# Altium schematic sheet SignalAndKeyController.SchDoc: Signal And Key Controller
size A4; Author: eldar6776@hotmail.com; DrawnBy: Eldar Dedić; Organization: PROVEN d.o.o.; Address1: Adema Buće 102; Address2: 71000 Sarajevo; Address3: Federacija BiH; Address4: Bosna i Hercegovina; DocumentNumber: DE211213; Revision: 001; SheetNumber: 10; SheetTotal: 15; ProjectName: MIKSER SIROVINE
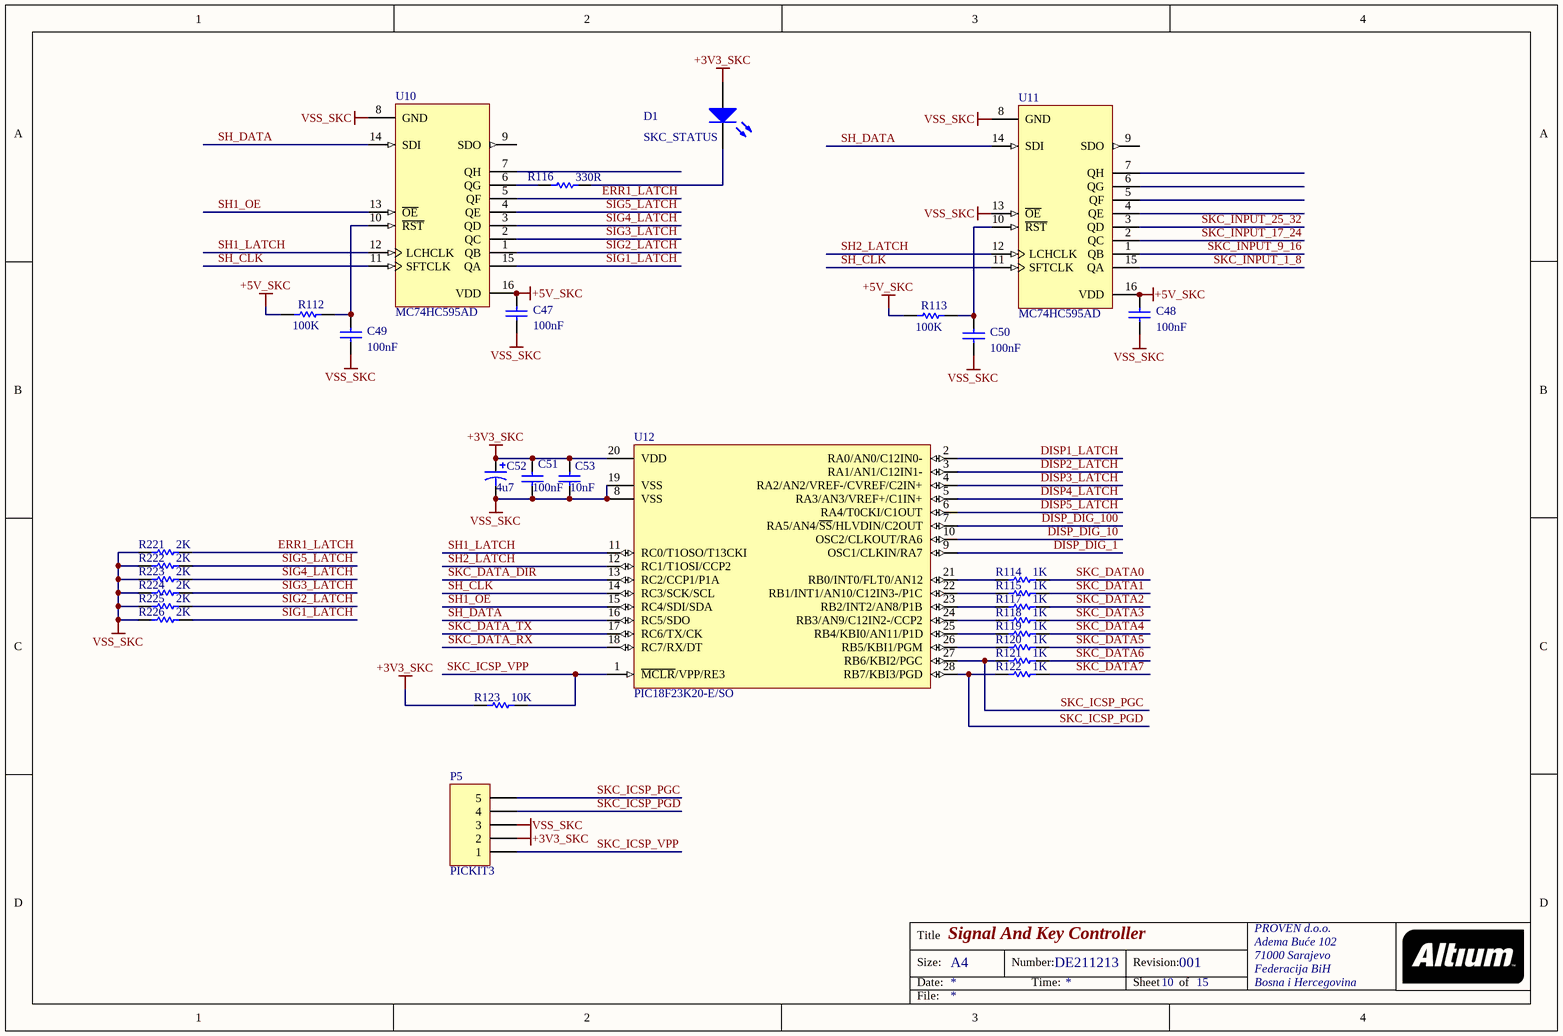
[diagram p0: SignalAndKeyController.SchDoc]

## Parts
C47  value 100nF  [1206]
C48  value 100nF  [1206]
C49  value 100nF  [1206]
C50  value 100nF  [1206]
C51  value 100nF  [1206]
C52  4u7  [C]
C53  value 10nF  [0805]
D1  SKC_STATUS  [2.0X1.25X0.8]
P5  PICKIT3  [HDR1X5]
R112  100K  [ERA-0603]
R113  100K  [ERA-0603]
R114  1K  [ERA-0603]
R115  1K  [ERA-0603]
R116  330R  [ERA-0603]
R117  1K  [ERA-0603]
R118  1K  [ERA-0603]
R119  1K  [ERA-0603]
R120  1K  [ERA-0603]
R121  1K  [ERA-0603]
R122  1K  [ERA-0603]
R123  10K  [ERA-0603]
R221  2K  [ERA-0603]
R222  2K  [ERA-0603]
R223  2K  [ERA-0603]
R224  2K  [ERA-0603]
R225  2K  [ERA-0603]
R226  2K  [ERA-0603]
U10  MC74HC595AD  [751B-05_N]
U11  MC74HC595AD  [751B-05_N]
U12  PIC18F23K20-E/SO  [SOIC-SO28_N]

## Nets
+3V3_SKC: C51.2 C52.1 C53.2 D1.1(A) P5.2 R123.1 U12.20(VDD)
+5V_SKC: C47.2 C48.2 R112.1 R113.1 U10.16(VDD) U11.16(VDD)
VSS_SKC: C47.1 C48.1 C49.1 C50.1 C51.1 C52.2 C53.1 P5.3 R221.2 R222.2 R223.2 R224.2 R225.2 R226.2 U10.8(GND) U11.8(GND) U11.13(~{OE}) U12.8(VSS) U12.19(VSS)
DISP1_LATCH: U12.2(RA0/AN0/C12IN0-)
DISP2_LATCH: U12.3(RA1/AN1/C12IN1-)
DISP3_LATCH: U12.4(RA2/AN2/VREF-/CVREF/C2IN+)
DISP4_LATCH: U12.5(RA3/AN3/VREF+/C1IN+)
DISP5_LATCH: U12.6(RA4/T0CKI/C1OUT)
DISP_DIG_1: U12.9(OSC1/CLKIN/RA7)
DISP_DIG_10: U12.10(OSC2/CLKOUT/RA6)
DISP_DIG_100: U12.7(RA5/AN4/~{SS}/HLVDIN/C2OUT)
ERR1_LATCH: R221.1 U10.5(QF)
SH1_LATCH: U10.12(LCHCLK) U12.11(RC0/T1OSO/T13CKI)
SH1_OE: U10.13(~{OE}) U12.15(RC4/SDI/SDA)
SH2_LATCH: U11.12(LCHCLK) U12.12(RC1/T1OSI/CCP2)
SH_CLK: U10.11(SFTCLK) U11.11(SFTCLK) U12.14(RC3/SCK/SCL)
SH_DATA: U10.14(SDI) U11.14(SDI) U12.16(RC5/SDO)
SIG1_LATCH: R226.1 U10.15(QA)
SIG2_LATCH: R225.1 U10.1(QB)
SIG3_LATCH: R224.1 U10.2(QC)
SIG4_LATCH: R223.1 U10.3(QD)
SIG5_LATCH: R222.1 U10.4(QE)
SKC_DATA0: R114.2
SKC_DATA1: R115.2
SKC_DATA2: R117.2
SKC_DATA3: R118.2
SKC_DATA4: R119.2
SKC_DATA5: R120.2
SKC_DATA6: R121.2
SKC_DATA7: R122.2
SKC_DATA_DIR: U12.13(RC2/CCP1/P1A)
SKC_DATA_RX: U12.18(RC7/RX/DT)
SKC_DATA_TX: U12.17(RC6/TX/CK)
SKC_ICSP_PGC: P5.5 R121.1 U12.27(RB6/KBI2/PGC)
SKC_ICSP_PGD: P5.4 R122.1 U12.28(RB7/KBI3/PGD)
SKC_ICSP_VPP: P5.1 R123.2 U12.1(~{MCLR}/VPP/RE3)
SKC_INPUT_1_8: U11.15(QA)
SKC_INPUT_9_16: U11.1(QB)
SKC_INPUT_17_24: U11.2(QC)
SKC_INPUT_25_32: U11.3(QD)
NetC49_2: C49.2 R112.2 U10.10(~{RST})
NetC50_2: C50.2 R113.2 U11.10(~{RST})
NetD1_2: D1.2(K) R116.2
NetR114_1: R114.1 U12.21(RB0/INT0/FLT0/AN12)
NetR115_1: R115.1 U12.22(RB1/INT1/AN10/C12IN3-/P1C)
NetR116_1: R116.1 U10.6(QG)
NetR117_1: R117.1 U12.23(RB2/INT2/AN8/P1B)
NetR118_1: R118.1 U12.24(RB3/AN9/C12IN2-/CCP2)
NetR119_1: R119.1 U12.25(RB4/KBI0/AN11/P1D)
NetR120_1: R120.1 U12.26(RB5/KBI1/PGM)

Not connected (* = marked no-connect by the designer): U10 7(QH) 9(SDO); U11 4(QE) 5(QF) 6(QG) 7(QH) 9(SDO)

## Notes on the sheet
- Title
- Size:
- Date:
- A4
- Number:
- Time:
- Revision:
- Sheet
- of
- File:

## Library data of the parts
C47-C51 = C1206: Ceramic Chip Capacitor - Standard; Published: 17-Jul-2002; LatestRevisionDate: 19-Mar-2004; LatestRevisionNote: Silkscreen size reduced.; DatasheetDocument: Mar-2001; PackageDocument: Mar-2001; PackageReference: 1206; Publisher: Altium Limited; Code_JEITA: 1206; Code_IPC: 3216 [1206]; ComponentLink1Description: Manufacturer Link; ComponentLink1URL: http://www.kemet.com/; ComponentLink2Description: Datasheet; ComponentLink2URL: http://www.kemet.com/kemet/web/homepage/kechome.nsf/vapubfilesname/F3102TA.pdf/$file/F3102TA.pdf
C52 = 94SC475X0025CBP: Solid Aluminum Capacitor with Organic Semiconductor Electrolyte: 4.7uF, 25V, Bulk Pack; Note: Part Numbers shown are for ± 20% capacitance tolerance (X0).; PCB_Layout: Complies with Manufacturer's Recommendation.; DrillSize: Nominal, Rounded to the nearest 0.1mm; Published: 19-Mar-2004; DatasheetDocument: 23-May-2001; PackageReference: C; Publisher: Altium Limited; ComponentLink1Description: Manufacturer Link; ComponentLink1URL: http://www.vishay.com/; ComponentLink2Description: Datasheet; ComponentLink2URL: http://www.vishay.com/docs/90004/94sc.pdf; Value: 4.7uF
C53 = C0805: Ceramic Chip Capacitor - Standard; Note: Footprint corresponds to dimensions for bulk cassette packaging. This case size has tightened tolerances.; Published: 17-Jul-2002; LatestRevisionDate: 19-Mar-2004; LatestRevisionNote: Silkscreen size reduced.; DatasheetDocument: Mar-2001; PackageDocument: Mar-2001; PackageReference: 0805; Publisher: Altium Limited; Code_JEITA: 0805; Code_IPC: 2012[0805]; ComponentLink1Description: Manufacturer Link; ComponentLink1URL: http://www.kemet.com/; ComponentLink2Description: Datasheet; ComponentLink2URL: http://www.kemet.com/kemet/web/homepage/kechome.nsf/vapubfilesname/F3102TA.pdf/$file/F3102TA.pdf
D1 = HSMA-S670: SMT Top Mount Chip LED, Amber; LuminousIntensity: 16mcd (Minimum).; PCB_Layout: Complies with manufacturer's recommendation.; Published: 11-Dec-2002; DatasheetVersion: 29-Oct-2001; PackageVersion: Oct-2001; PackageReference: 2.0X1.25X0.8; Publisher: Altium Limited; PackageDescription: SM LED; 2 Flat Leads; LED_Colour: Amber; ComponentLink1Description: Manufacturer Link; ComponentLink1URL: http://www.avagotech.com/; ComponentLink2Description: Datasheet; ComponentLink2URL: http://cp.literature.agilent.com/litweb/pdf/5988-4445EN.pdf
P5 = Header 5: Header, 5-Pin; LatestRevisionDate: 17-Jul-2002; LatestRevisionNote: Re-released for DXP Platform.; Publisher: Altium Limited
R112-R123 R221-R226 = ERA3Y: Rectangular Thick Film Chip Resistor, 10 Ohm to 330k Ohm Range, 0.1% and 0.5% Tolerance, 0603 Size, 0.063 W; Note: If flow soldering, adjust pad width of PCB Footprint to 0.7 - 0.8 times the width of the resistor.; Published: 17-Dec-2003; LatestRevisionDate: 19-Mar-2004; LatestRevisionNote: Silkscreen size reduced.; PackageDocument: Mar-2003; PackageReference: ERA-0603; Publisher: Altium Limited; Code_IPC: 1608 [0603]; ComponentLink1Description: Manufacturer Link; ComponentLink1URL: http://www.panasonic.com/industrial/components/resistive_products.htm; ComponentLink2Description: Datasheet; ComponentLink2URL: http://www.panasonic.com/industrial/components/pdf/AOA0000CE8.pdf
U10 U11 = MC74HC595AD: 8-Bit Serial-Input/Serial or Prallel-Output Shift Register with Latched 3-State Outputs; Published: 15-Apr-2002; LatestRevisionDate: 13-Apr-2006; LatestRevisionNote: IPC-7351 Footprint Added.; DatasheetVersion: Mar-2000; PackageVersion: Oct-1999; PackageReference: 751B-05; Publisher: Altium Limited; PackageDescription: 16-Pin Small Outline Integrated Circuit 1.27 mm Pitch; Code_JEDEC: MS-012-AC; Code_IPC: SOIC127P600-16; ComponentLink1Description: Manufacturer Link; ComponentLink1URL: http://www.onsemi.com/; ComponentLink2Description: Datasheet; ComponentLink2URL: http://www.onsemi.com/pub/Collateral/MC74HC595A-D.PDF
U12 = PIC18F23K20-E/SO: Flash Microcontroller with nanoWatt XLP Technology, 28-pin SOIC, Extended Temperature; Published: 2-Dec-2009; DatasheetVersion: revF, Sep-2009; PackageVersion: revBB, Aug-2009; PackageReference: SOIC-SO28; Publisher: Altium Limited; PackageDescription: 28-Lead Plastic Small Outline (SO) - Wide 7.50mm Body [SOIC]; Supplier 1: Digi-Key; Supplier Part Number 1: PIC18F23K20-E/SO-ND; Code_JEDEC: MS-013; ComponentLink1Description: Datasheet; ComponentLink1URL: http://ww1.microchip.com/downloads/en/DeviceDoc/41303F.pdf; ComponentLink2Description: Packaging Specification; ComponentLink2URL: http://www.microchip.com/stellent/groups/techpub_sg/documents/packagingspec/en012702.pdf; ComponentLink3Description: Microchip.com Home; ComponentLink3URL: http://www.microchip.com/